# Altium schematic sheet DPPXHK_10CL010_GRAPHICS.SchDoc
size A4
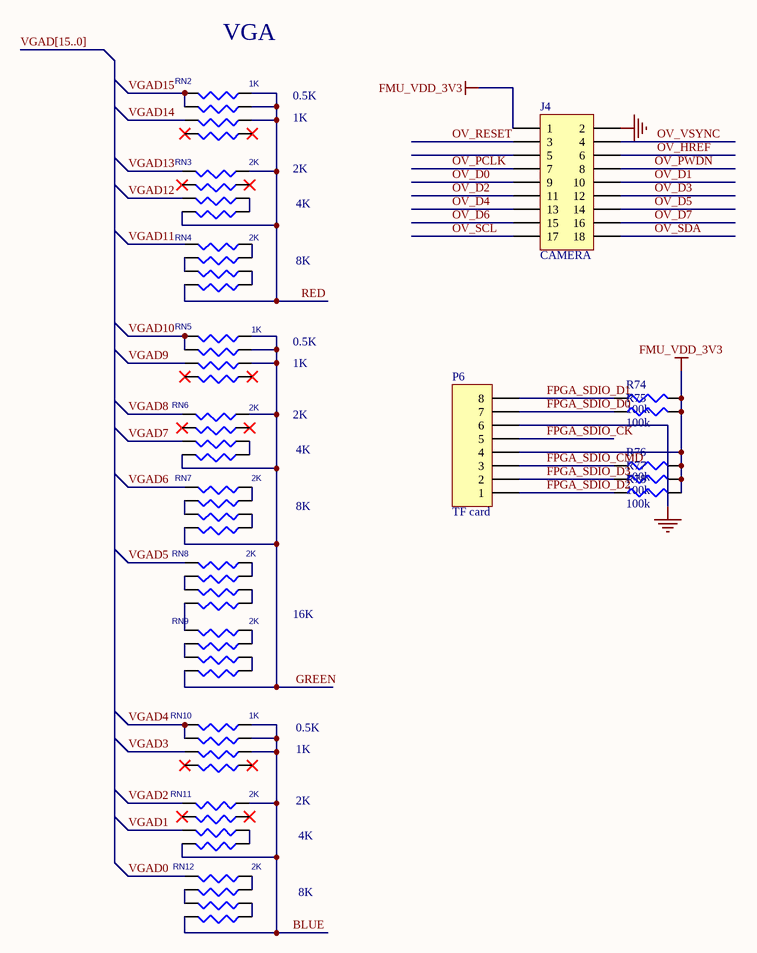
[diagram p0: DPPXHK_10CL010_GRAPHICS.SchDoc]

## Parts
J4  CAMERA  [FPC-0.5-18]
P6  TF card  [TF-2]
R74  100k  [0402R]
R75  100k  [0402R]
R76  100k  [0402R]
R77  100k  [0402R]
R78  100k  [0402R]
RN2  1K  [RN-8P]
RN3  2K  [RN-8P]
RN4  2K  [RN-8P]
RN5  1K  [RN-8P]
RN6  2K  [RN-8P]
RN7  2K  [RN-8P]
RN8  2K  [RN-8P]
RN9  2K  [RN-8P]
RN10  1K  [RN-8P]
RN11  2K  [RN-8P]
RN12  2K  [RN-8P]

## Nets
FMU_VDD_3V3: J4.1 P6.4 R74.2 R75.2 R76.2 R77.2 R78.2
GND: J4.2 P6.6
BLUE: RN10.2 RN10.3 RN10.4 RN11.4 RN11.8 RN12.8
FPGA_SDIO_CK: P6.5
FPGA_SDIO_CMD: P6.3 R76.1
FPGA_SDIO_D0: P6.7 R75.1
FPGA_SDIO_D1: P6.8 R74.1
FPGA_SDIO_D2: P6.1 R78.1
FPGA_SDIO_D3: P6.2 R77.1
GREEN: RN5.2 RN5.3 RN5.4 RN6.4 RN6.8 RN7.8 RN9.8
OV_D0: J4.9
OV_D1: J4.10
OV_D2: J4.11
OV_D3: J4.12
OV_D4: J4.13
OV_D5: J4.14
OV_D6: J4.15
OV_D7: J4.16
OV_HREF: J4.6
OV_PCLK: J4.7
OV_PWDN: J4.8
OV_RESET: J4.3
OV_SCL: J4.17
OV_SDA: J4.18
OV_VSYNC: J4.4
RED: RN2.2 RN2.3 RN2.4 RN3.4 RN3.8 RN4.8
VGAD0: RN12.5
VGAD1: RN11.7
VGAD2: RN11.5
VGAD3: RN10.7
VGAD4: RN10.5 RN10.6
VGAD5: RN8.5
VGAD6: RN7.5
VGAD7: RN6.7
VGAD8: RN6.5
VGAD9: RN5.7
VGAD10: RN5.5 RN5.6
VGAD11: RN4.5
VGAD12: RN3.7
VGAD13: RN3.5
VGAD14: RN2.7
VGAD15: RN2.5 RN2.6
NetRN3_1: RN3.1 RN3.2
NetRN4_1: RN4.1 RN4.2
NetRN4_3: RN4.3 RN4.4
NetRN4_6: RN4.6 RN4.7
NetRN6_1: RN6.1 RN6.2
NetRN7_1: RN7.1 RN7.2
NetRN7_3: RN7.3 RN7.4
NetRN7_6: RN7.6 RN7.7
NetRN8_1: RN8.1 RN8.2
NetRN8_3: RN8.3 RN8.4
NetRN8_6: RN8.6 RN8.7
NetRN8_8: RN8.8 RN9.5
NetRN9_1: RN9.1 RN9.2
NetRN9_3: RN9.3 RN9.4
NetRN9_6: RN9.6 RN9.7
NetRN11_1: RN11.1 RN11.2
NetRN12_1: RN12.1 RN12.2
NetRN12_3: RN12.3 RN12.4
NetRN12_6: RN12.6 RN12.7

Not connected (* = marked no-connect by the designer): J4 5; RN2 1* 8*; RN3 3* 6*; RN5 1* 8*; RN6 3* 6*; RN10 1* 8*; RN11 3* 6*

## Buses and harness runs
bus VGAD[15..0]

## Notes on the sheet
- (near RN2) VGA
- 0.5K
- 1K
- 2K
- 4K
- 8K
- 16K

## Library data of the parts
J4 = Header 9X2: Header, 9-Pin, Dual row; LatestRevisionDate: 17-Jul-2002; LatestRevisionNote: Re-released for DXP Platform.; Publisher: Altium Limited
P6 = Header 8: Header, 8-Pin; LatestRevisionDate: 17-Jul-2002; LatestRevisionNote: Re-released for DXP Platform.; Publisher: Altium Limited
R74-R78 = Res3: Resistor; Published: 8-Jun-2000; LatestRevisionDate: 4-Mar-2005; LatestRevisionNote: PCB Footprint replaced.; Publisher: Altium Limited
RN2-RN12 = RN_Dup1